# Altium schematic sheet STM32F103_开关量输出.SchDoc
size A2; SheetNumber: 2; SheetTotal: 4
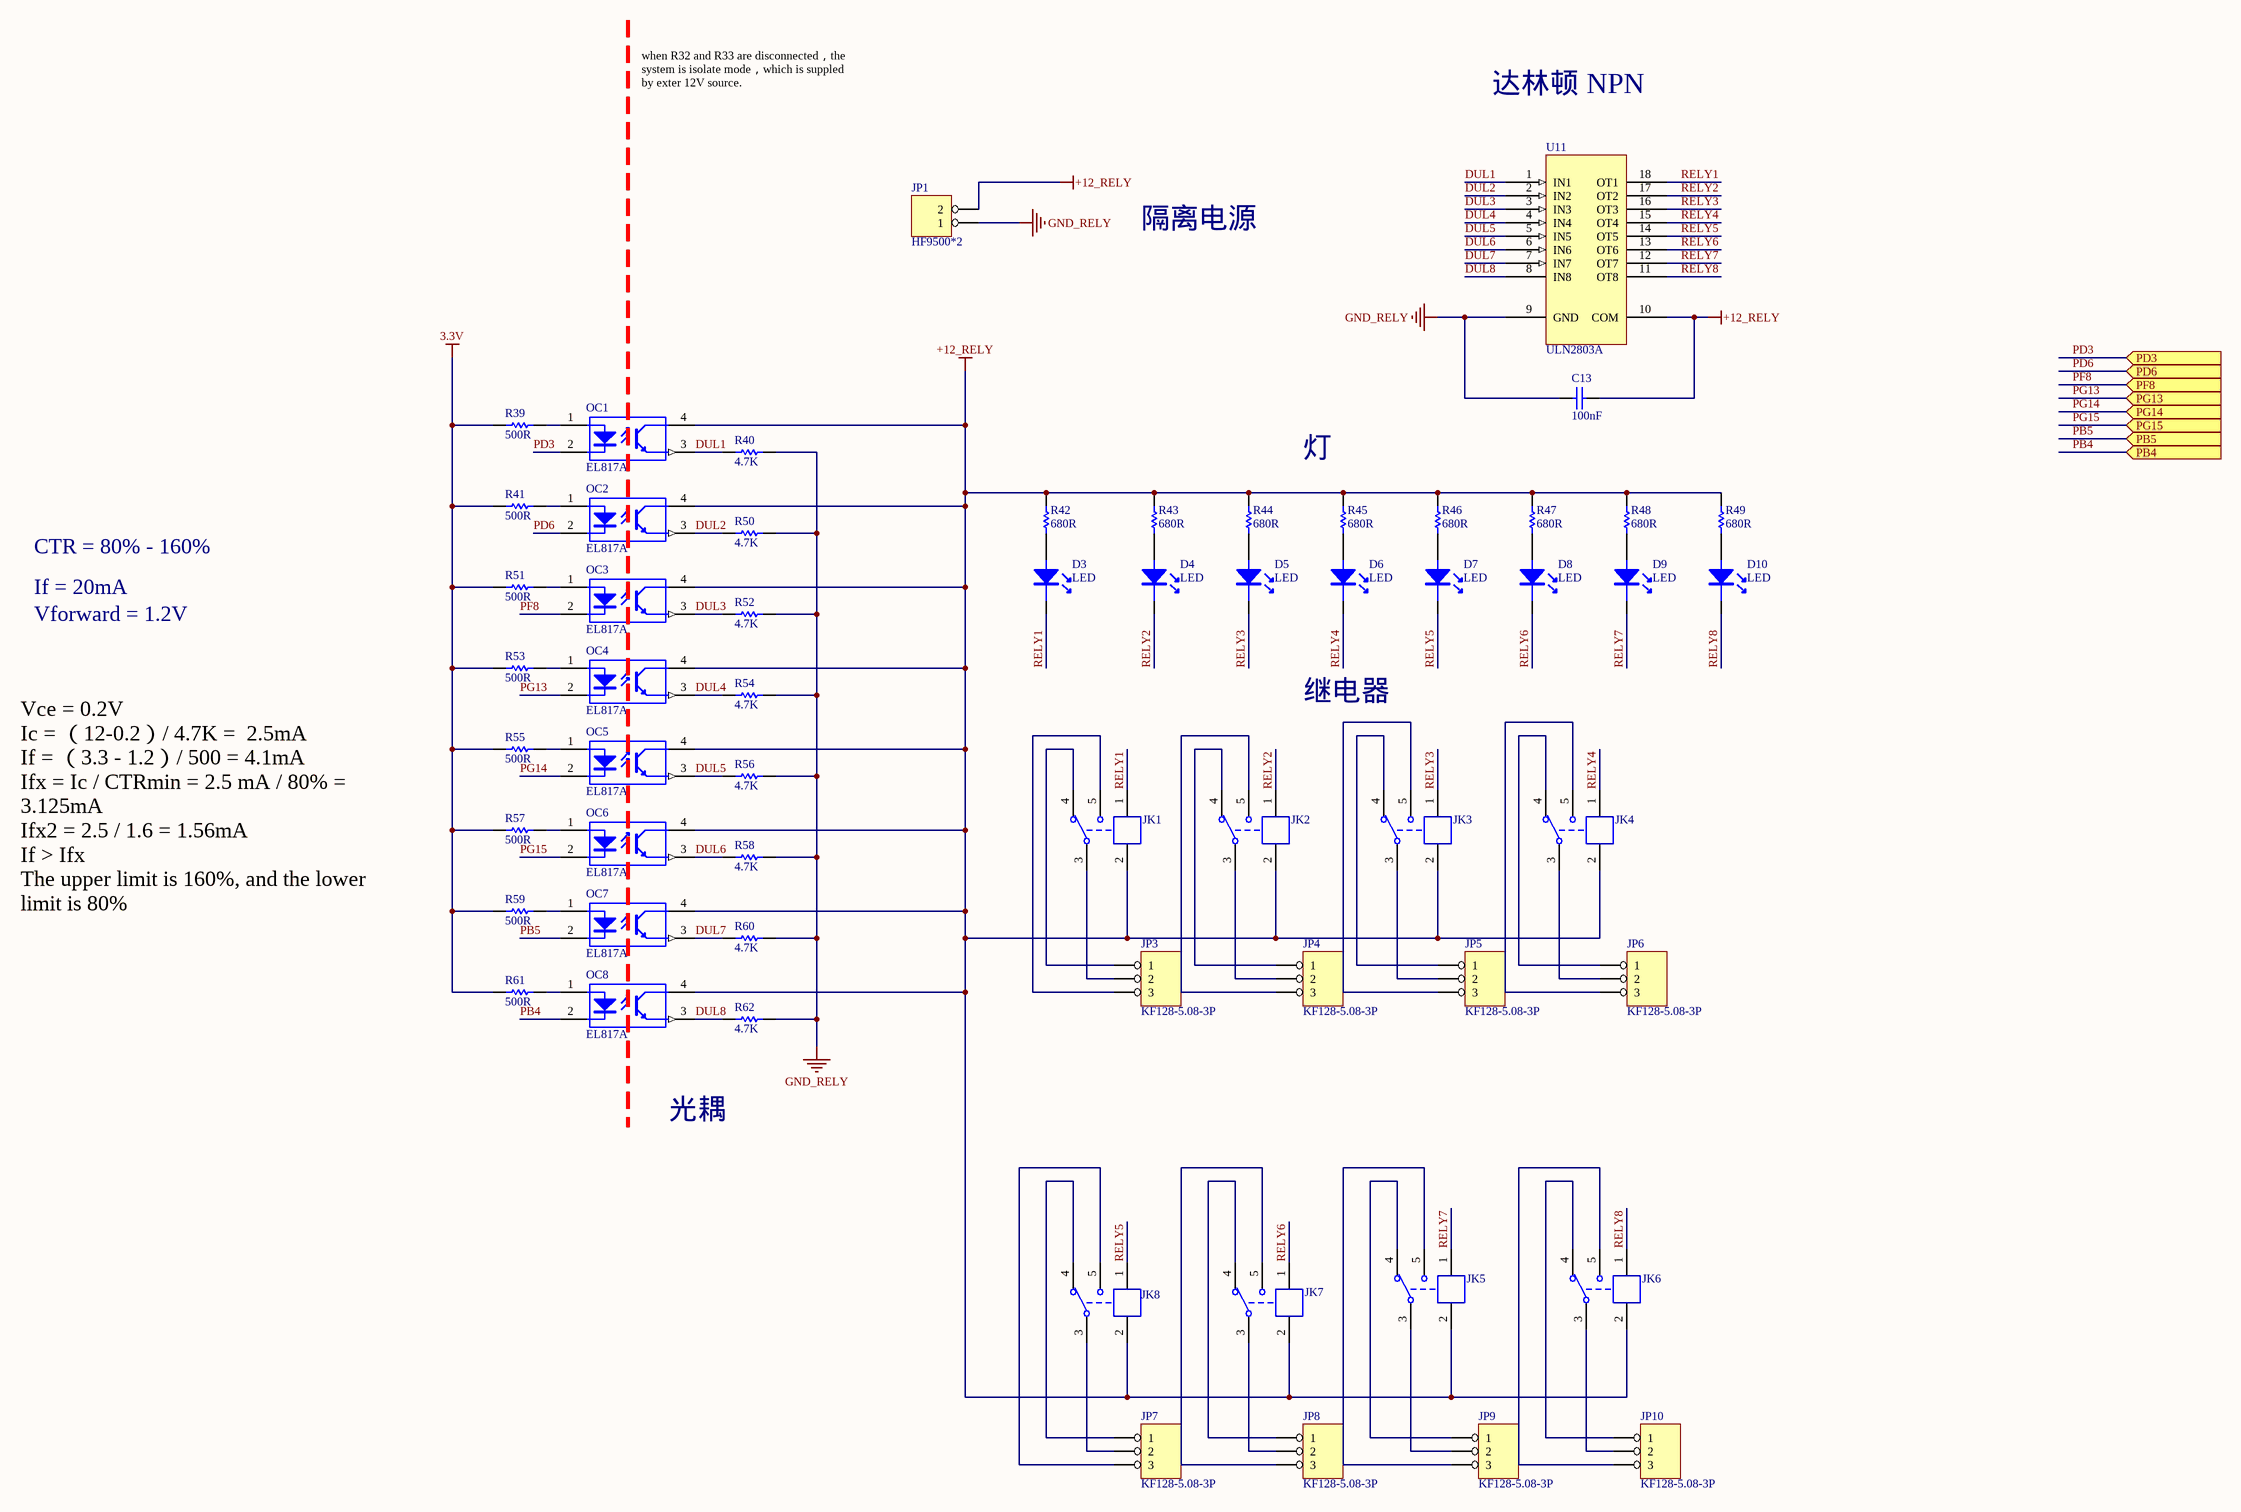
[diagram p0: STM32F103_开关量输出.SchDoc]

## Parts
C13  100nF  [0603C]
D3  LED  [LED-0603G]
D4  LED  [LED-0603G]
D5  LED  [LED-0603G]
D6  LED  [LED-0603G]
D7  LED  [LED-0603G]
D8  LED  [LED-0603G]
D9  LED  [LED-0603G]
D10  LED  [LED-0603G]
JK1  SRD-05VDC-SL-C  [SRD-C_B]  (value not drawn)
JK2  SRD-05VDC-SL-C  [SRD-C_B]  (value not drawn)
JK3  SRD-05VDC-SL-C  [SRD-C_B]  (value not drawn)
JK4  SRD-05VDC-SL-C  [SRD-C_B]  (value not drawn)
JK5  SRD-05VDC-SL-C  [SRD-C_B]  (value not drawn)
JK6  SRD-05VDC-SL-C  [SRD-C_B]  (value not drawn)
JK7  SRD-05VDC-SL-C  [SRD-C_B]  (value not drawn)
JK8  SRD-05VDC-SL-C  [SRD-C_B]  (value not drawn)
JP1  HF9500*2  [KF128-5.08-2P]
JP3  KF128-5.08-3P  [KF128-5.08-3P]
JP4  KF128-5.08-3P  [KF128-5.08-3P]
JP5  KF128-5.08-3P  [KF128-5.08-3P]
JP6  KF128-5.08-3P  [KF128-5.08-3P]
JP7  KF128-5.08-3P  [KF128-5.08-3P]
JP8  KF128-5.08-3P  [KF128-5.08-3P]
JP9  KF128-5.08-3P  [KF128-5.08-3P]
JP10  KF128-5.08-3P  [KF128-5.08-3P]
OC1  EL817A  [SMD_PC817]
OC2  EL817A  [SMD_PC817]
OC3  EL817A  [SMD_PC817]
OC4  EL817A  [SMD_PC817]
OC5  EL817A  [SMD_PC817]
OC6  EL817A  [SMD_PC817]
OC7  EL817A  [SMD_PC817]
OC8  EL817A  [SMD_PC817]
R39  500R  [0805R]
R40  4.7K  [0603R]
R41  500R  [0805R]
R42  680R  [0805R]
R43  680R  [0805R]
R44  680R  [0805R]
R45  680R  [0805R]
R46  680R  [0805R]
R47  680R  [0805R]
R48  680R  [0805R]
R49  680R  [0805R]
R50  4.7K  [0603R]
R51  500R  [0805R]
R52  4.7K  [0603R]
R53  500R  [0805R]
R54  4.7K  [0603R]
R55  500R  [0805R]
R56  4.7K  [0603R]
R57  500R  [0805R]
R58  4.7K  [0603R]
R59  500R  [0805R]
R60  4.7K  [0603R]
R61  500R  [0805R]
R62  4.7K  [0603R]
U11  ULN2803A  [SOP18 - 300mil]

## Ports
PB4 (in), PB5 (in), PD3 (in), PD6 (in), PF8 (in), PG13 (in), PG14 (in), PG15 (in)

## Nets
3.3V: R39.2 R41.2 R51.2 R53.2 R55.2 R57.2 R59.2 R61.2
+12_RELY: C13.2 JK1.2 JK2.2 JK3.2 JK4.2 JK5.2 JK6.2 JK7.2 JK8.2 JP1.2 OC1.4(C) OC2.4(C) OC3.4(C) OC4.4(C) OC5.4(C) OC6.4(C) OC7.4(C) OC8.4(C) R42.1 R43.1 R44.1 R45.1 R46.1 R47.1 R48.1 R49.1 U11.10(COM)
GND_RELY: C13.1 JP1.1 R40.2 R50.2 R52.2 R54.2 R56.2 R58.2 R60.2 R62.2 U11.9(GND)
DUL1: OC1.3(E) R40.1 U11.1(IN1)
DUL2: OC2.3(E) R50.1 U11.2(IN2)
DUL3: OC3.3(E) R52.1 U11.3(IN3)
DUL4: OC4.3(E) R54.1 U11.4(IN4)
DUL5: OC5.3(E) R56.1 U11.5(IN5)
DUL6: OC6.3(E) R58.1 U11.6(IN6)
DUL7: OC7.3(E) R60.1 U11.7(IN7)
DUL8: OC8.3(E) R62.1 U11.8(IN8)
PB4: OC8.2(K) ; port PB4
PB5: OC7.2(K) ; port PB5
PD3: OC1.2(K) ; port PD3
PD6: OC2.2(K) ; port PD6
PF8: OC3.2(K) ; port PF8
PG13: OC4.2(K) ; port PG13
PG14: OC5.2(K) ; port PG14
PG15: OC6.2(K) ; port PG15
RELY1: D3.2(K) JK1.1 U11.18(OT1)
RELY2: D4.2(K) JK2.1 U11.17(OT2)
RELY3: D5.2(K) JK3.1 U11.16(OT3)
RELY4: D6.2(K) JK4.1 U11.15(OT4)
RELY5: D7.2(K) JK8.1 U11.14(OT5)
RELY6: D8.2(K) JK7.1 U11.13(OT6)
RELY7: D9.2(K) JK5.1 U11.12(OT7)
RELY8: D10.2(K) JK6.1 U11.11(OT8)
NetD3_1: D3.1(A) R42.2
NetD4_1: D4.1(A) R43.2
NetD5_1: D5.1(A) R44.2
NetD6_1: D6.1(A) R45.2
NetD7_1: D7.1(A) R46.2
NetD8_1: D8.1(A) R47.2
NetD9_1: D9.1(A) R48.2
NetD10_1: D10.1(A) R49.2
NetJK1_3: JK1.3 JP3.2
NetJK1_4: JK1.4 JP3.1
NetJK1_5: JK1.5 JP3.3
NetJK2_3: JK2.3 JP4.2
NetJK2_4: JK2.4 JP4.1
NetJK2_5: JK2.5 JP4.3
NetJK3_3: JK3.3 JP5.2
NetJK3_4: JK3.4 JP5.1
NetJK3_5: JK3.5 JP5.3
NetJK4_3: JK4.3 JP6.2
NetJK4_4: JK4.4 JP6.1
NetJK4_5: JK4.5 JP6.3
NetJK5_3: JK5.3 JP9.2
NetJK5_4: JK5.4 JP9.1
NetJK5_5: JK5.5 JP9.3
NetJK6_3: JK6.3 JP10.2
NetJK6_4: JK6.4 JP10.1
NetJK6_5: JK6.5 JP10.3
NetJK7_3: JK7.3 JP8.2
NetJK7_4: JK7.4 JP8.1
NetJK7_5: JK7.5 JP8.3
NetJK8_3: JK8.3 JP7.2
NetJK8_4: JK8.4 JP7.1
NetJK8_5: JK8.5 JP7.3
NetOC1_1: OC1.1(A) R39.1
NetOC2_1: OC2.1(A) R41.1
NetOC3_1: OC3.1(A) R51.1
NetOC4_1: OC4.1(A) R53.1
NetOC5_1: OC5.1(A) R55.1
NetOC6_1: OC6.1(A) R57.1
NetOC7_1: OC7.1(A) R59.1
NetOC8_1: OC8.1(A) R61.1

## Notes on the sheet
- when R32 and R33 are disconnected，the system is isolate mode，which is suppled by exter 12V source.
- 达林顿 NPN
- 隔离电源
- 灯
- CTR = 80% - 160%
- If = 20mA
- Vforward = 1.2V
- 继电器
- Vce = 0.2V
  Ic = （12-0.2）/ 4.7K =  2.5mA
  If = （3.3 - 1.2）/ 500 = 4.1mA
  Ifx = Ic / CTRmin = 2.5 mA / 80% = 3.125mA
  Ifx2 = 2.5 / 1.6 = 1.56mA
  If > Ifx
  The upper limit is 160%, and the lower limit is 80%
- 光耦

## Library data of the parts
C13 = CAP: Capacitor; Value: 104; Published: 8-Jun-2000; LatestRevisionDate: 17-Jul-2002; LatestRevisionNote: Re-released for DXP Platform.; PackageReference: RAD-0.3; Publisher: Altium Limited
D3-D10 = LED: LED 发光二极管
JK1-JK8 = SRD-05VDC-SL-C: 5V一组转换
JP1 = HEADER 2
JP3-JP10 = HEADER 3
OC1-OC8 = EL357N: 线性光耦
R39-R62 = RES: Resistor; Value: 1K; Published: 8-Jun-2000; Revision: July-2002: Re-released for DXP Platform.; Publisher: Altium Limited
U11 = ULN2803A: 8 channels Darlington